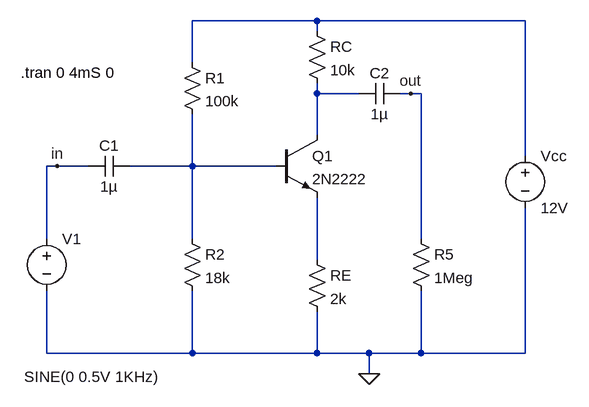
[diagram p0: schematic Draft1.asc]
Draft1.asc, the LTspice schematic file:
Version 4
SHEET 1 880 680
WIRE 144 -288 -48 -288
WIRE 464 -288 144 -288
WIRE 144 -272 144 -288
WIRE -48 -224 -48 -288
WIRE 144 -176 144 -192
WIRE 208 -176 144 -176
WIRE 288 -176 272 -176
WIRE 304 -176 288 -176
WIRE 144 -112 144 -176
WIRE 464 -80 464 -288
WIRE -256 -64 -272 -64
WIRE -208 -64 -256 -64
WIRE -48 -64 -48 -144
WIRE -48 -64 -144 -64
WIRE 80 -64 -48 -64
WIRE -272 48 -272 -64
WIRE -48 48 -48 -64
WIRE 304 48 304 -176
WIRE 144 80 144 -16
WIRE -272 224 -272 128
WIRE -48 224 -48 128
WIRE -48 224 -272 224
WIRE 144 224 144 160
WIRE 144 224 -48 224
WIRE 224 224 144 224
WIRE 304 224 304 128
WIRE 304 224 224 224
WIRE 464 224 464 0
WIRE 464 224 304 224
WIRE 224 256 224 224
FLAG 224 256 0
FLAG -256 -64 in
FLAG 288 -176 out
SYMBOL npn 80 -112 R0
SYMATTR InstName Q1
SYMATTR Value 2N2222
SYMBOL res -64 -240 R0
SYMATTR InstName R1
SYMATTR Value 100k
SYMBOL res -64 32 R0
SYMATTR InstName R2
SYMATTR Value 18k
SYMBOL res 128 -288 R0
SYMATTR InstName RC
SYMATTR Value 10k
SYMBOL res 128 64 R0
SYMATTR InstName RE
SYMATTR Value 2k
SYMBOL res 288 32 R0
SYMATTR InstName R5
SYMATTR Value 1Meg
SYMBOL cap -208 -48 R270
WINDOW 0 32 32 VTop 2
WINDOW 3 0 32 VBottom 2
SYMATTR InstName C1
SYMATTR Value 1µ
SYMBOL cap 208 -160 R270
WINDOW 0 32 32 VTop 2
WINDOW 3 0 32 VBottom 2
SYMATTR InstName C2
SYMATTR Value 1µ
SYMBOL voltage -272 32 R0
WINDOW 3 -35 228 Left 2
SYMATTR InstName V1
SYMATTR Value SINE(0 0.5V 1KHz)
SYMBOL voltage 464 -96 R0
SYMATTR InstName Vcc
SYMATTR Value 12V
TEXT -312 -208 Left 2 !.tran 0 4mS 0

The netlist it stands for:
* Draft1.asc
Q1 N002 N003 N004 0 2N2222
R1 N001 N003 100k
R2 N003 0 18k
RC N001 N002 10k
RE N004 0 2k
R5 out 0 1Meg
C1 in N003 1µ
C2 N002 out 1µ
V1 in 0 SINE(0 0.5V 1KHz)
Vcc N001 0 12V
.model NPN NPN
.model PNP PNP
.lib standard.bjt
.tran 0 4mS 0
.backanno
.end